# EAGLE design WAM-D (EAGLE 9.5.0)
DOCNUM: WAM-D; REV: a1; TITLE: Wizard-Architect's Mana Dock
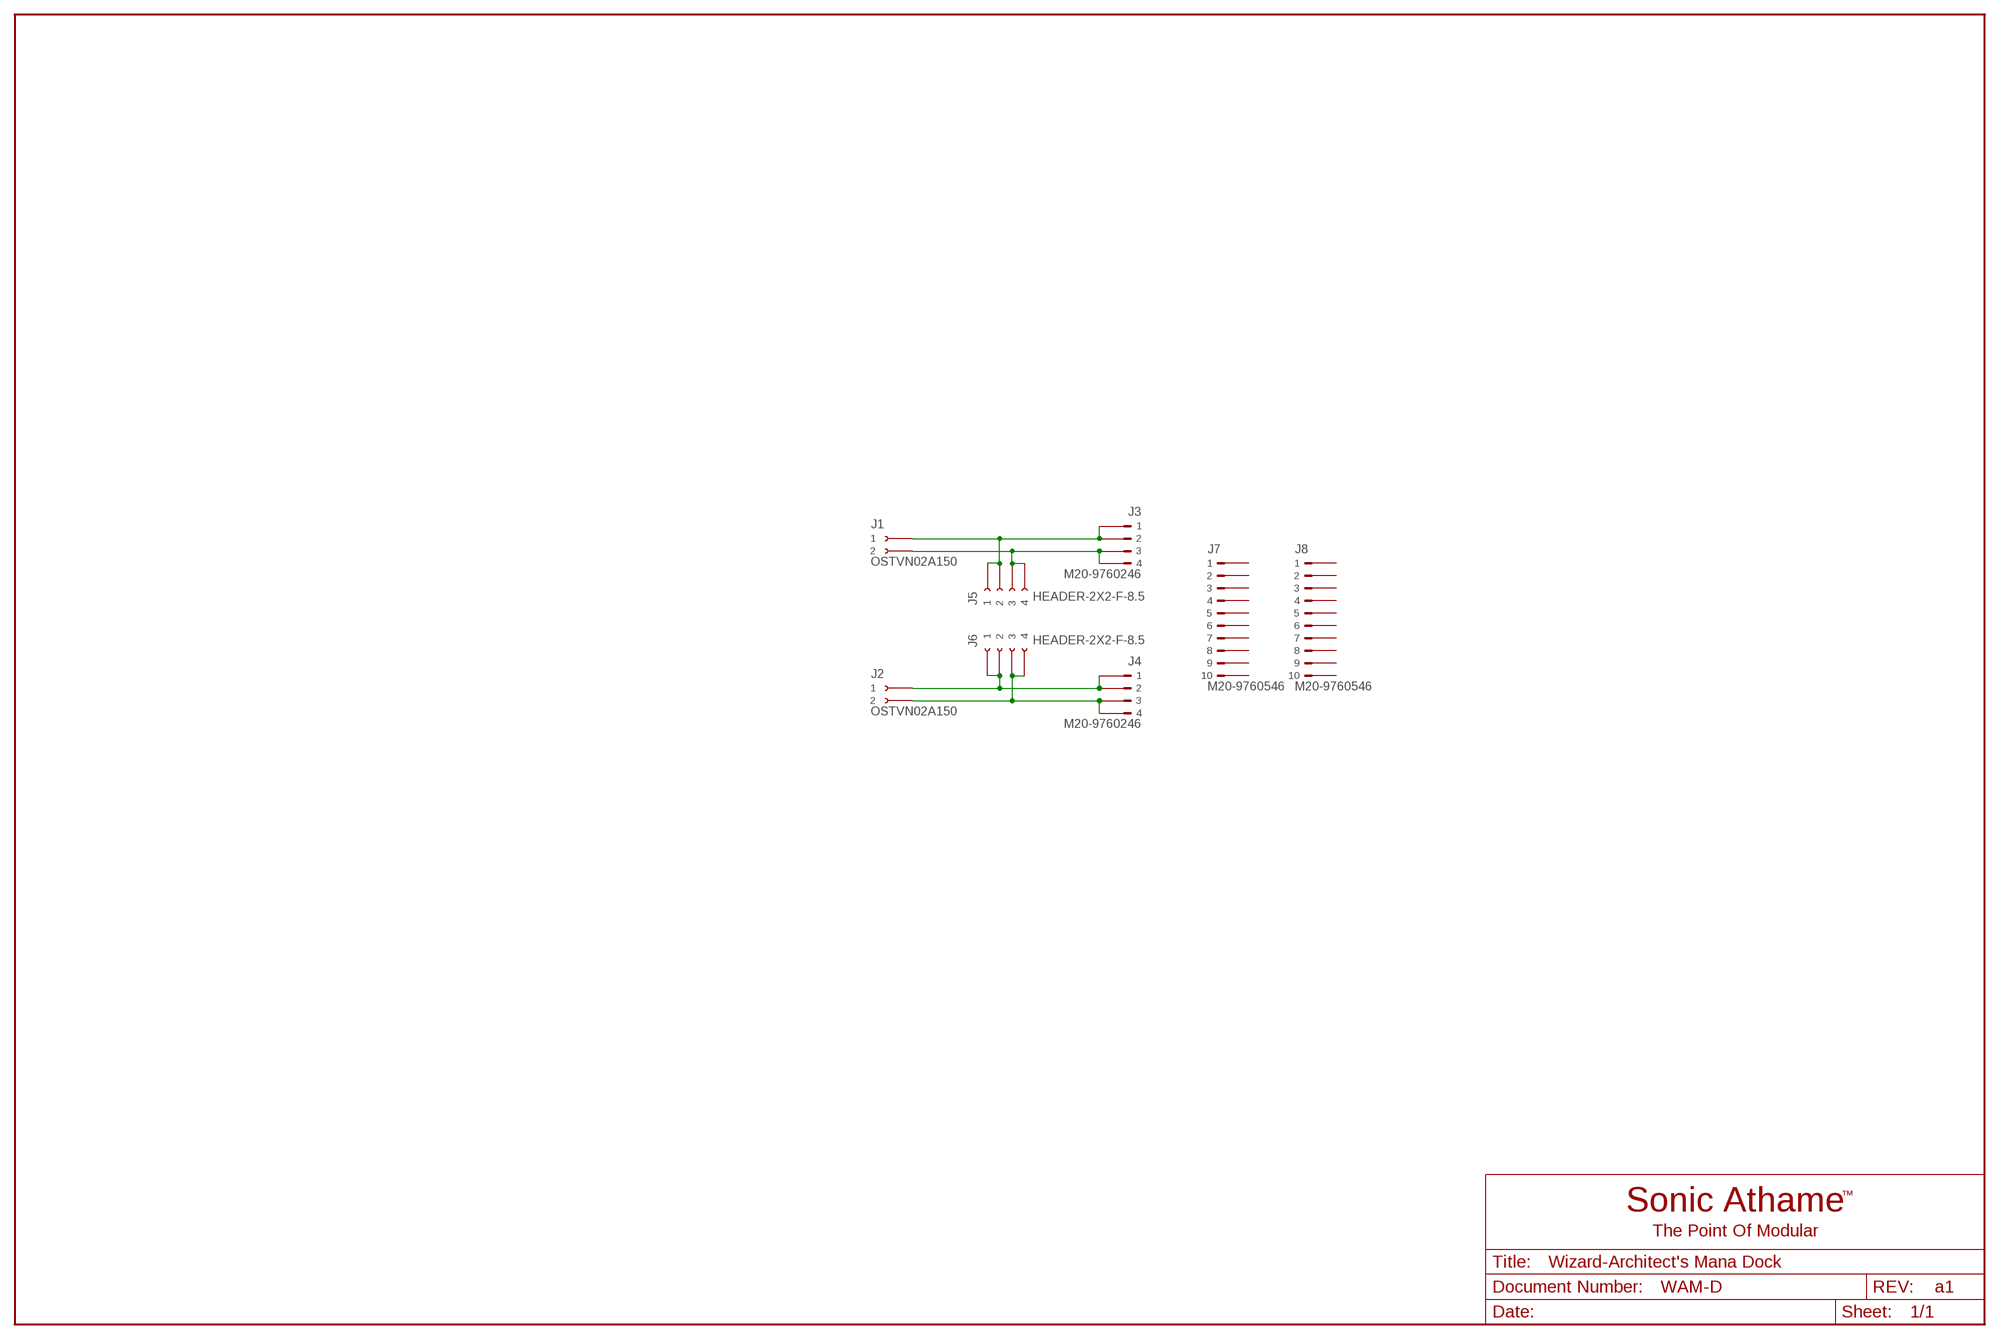
[diagram p0: schematic, sheet 1]

## Parts
J1  OSTVN02A150  [OSTVN02A150]
J2  OSTVN02A150  [OSTVN02A150]
J3  M20-9760246  [HDRV4W64P254_2X2_508X508X834B]
J4  M20-9760246  [HDRV4W64P254_2X2_508X508X834B]
J5  HEADER-2X2-F-8.5  [HDRVR4W75P254_2X2_558X508X850B]
J6  HEADER-2X2-F-8.5  [HDRVR4W75P254_2X2_558X508X850B]
J7  M20-9760546  [HDRV10W64P254_2X5_1270X508X834B]
J8  M20-9760546  [HDRV10W64P254_2X5_1270X508X834B]

## Nets
N$5: J2.P$1 J4.1 J4.2 J6.1 J6.2
N$6: J2.P$2 J4.3 J4.4 J6.3 J6.4
N$7: J1.P$2 J3.3 J3.4 J5.3 J5.4
N$8: J1.P$1 J3.1 J3.2 J5.1 J5.2
Unconnected: J7.1 J7.2 J7.3 J7.4 J7.5 J7.6 J7.7 J7.8 J7.9 J7.10 J8.1 J8.2 J8.3 J8.4 J8.5 J8.6 J8.7 J8.8 J8.9 J8.10

## Library data of the parts
J1 J2 = SonicAthame:OSTVN02A150
J3 J4 = SonicAthame:M20-9760246: Tin
J5 J6 = SonicAthame:HEADER-2X2-F-8.5
J7 J8 = SonicAthame:M20-9760546: Tin

## Board
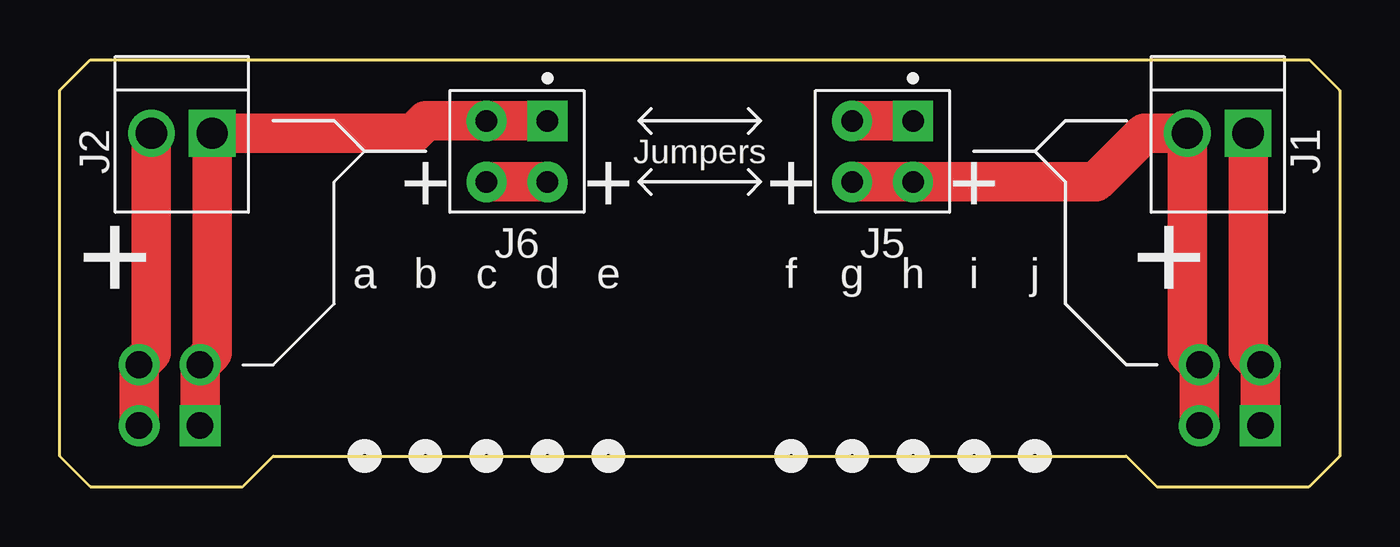
[diagram p1: board, top side]
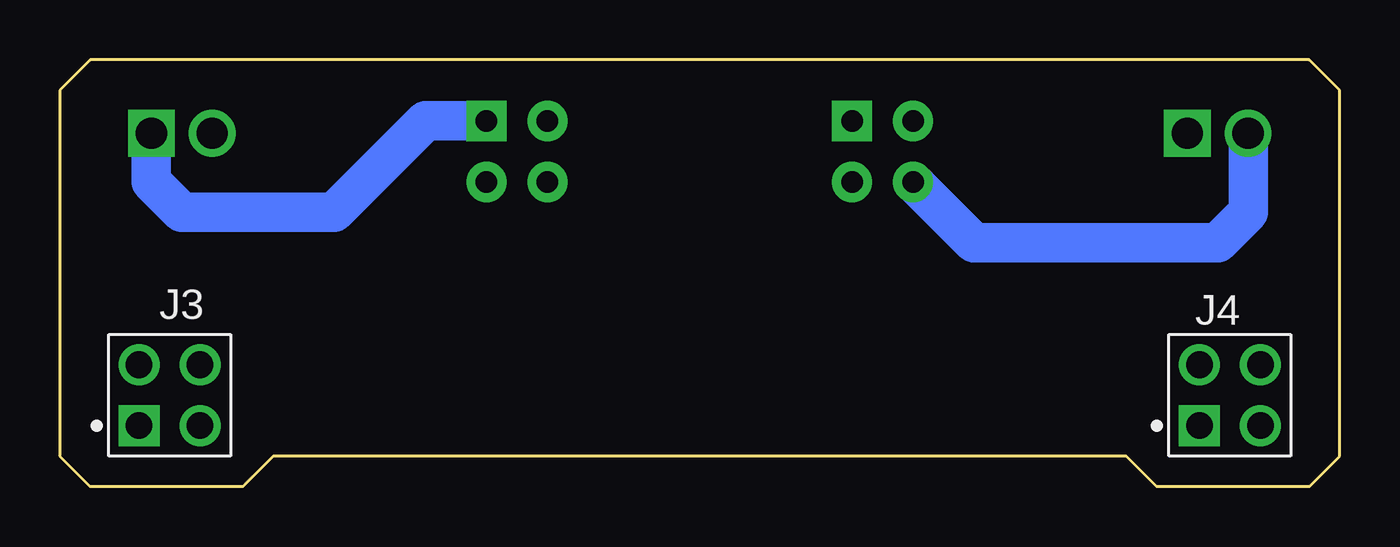
[diagram p2: board, bottom side, seen from below]

Size 53.34 x 17.78 mm. Coordinates in mm from the lower left corner, seen from the top.
Outline: 1.27,0 0,1.27 0,16.51 1.27,17.78 52.07,17.78 53.34,16.51 53.34,1.27 52.07,0 45.72,0 44.45,1.27 8.89,1.27 7.62,0 1.27,0
Copper layers (1*16): Top 0.035mm / dielectric 1.5mm / Bottom 0.035mm
Design rules "default": minimum track width 6mil, minimum drill 0.35mm, track to track 6mil, track to pad 6mil, pad to pad 6mil, via to via 6mil, smd to smd 6mil, copper to edge 40mil, drill to drill 6mil, minimum pad ring 10mil, minimum via ring 8mil, stop-mask expansion 4mil, vias tented up to drill 0mil, thermal gap 10mil

### Footprints (pad centres in the part's own frame; a part is rotated, then mirrored left to right if it is on the bottom)
OSTVN02A150 = drill 1.3 square: P$1 -1.27,0 | drill 1.3: P$2 1.27,0
HDRV4W64P254_2X2_508X508X834B = drill 1.105 pad 1.705 square: 1 0,0 | drill 1.105 pad 1.705: 2 2.54,0; 3 2.54,-2.54; 4 0,-2.54
HDRVR4W75P254_2X2_558X508X850B = drill 0.9 pad 1.676 square: 1 -1.27,-1.27 | drill 0.9 pad 1.676: 2 1.27,-1.27; 3 1.27,1.27; 4 -1.27,1.27

### Placement (x,y rotation side)
J1  48.26,14.73 180 top
J2  5.08,14.73 180 top
J3  50.04,2.54 90 bottom
J4  5.84,2.54 90 bottom
J5  34.29,13.97 180 top
J6  19.05,13.97 180 top

### Tracks (layer width: path | path; a pad name or v marks a point on that pad's centre or on a via)
N$5
  Top 1.651: J6.1 J6.2 15.24,15.24 14.73,14.73 12.7,14.73 J2.P$1 6.35,5.59 J4.2 J4.1
N$6
  Top 1.651: J2.P$2 3.81,5.59 J4.3 J4.4 | J6.3 J6.4
  Bottom 1.651: J2.P$2 3.81,11.43 5.08,10.16 15.24,10.16 J6.3
N$7
  Top 1.651: J3.4 J3.3 46.99,5.59 J1.P$2 45.21,14.73 43.18,12.7 J5.4 J5.3
N$8
  Top 1.651: J1.P$1 49.53,5.59 J3.2 J3.1 | J5.2 J5.1
  Bottom 1.651: J1.P$1 49.53,12.7 48.26,11.43 41.91,11.43 38.1,15.24 J5.1

### Text on the board
tNames: ﹣ | ﹣ | ﹣ | ﹣ | Jumpers | + | + | + | + | + | ﹣ | a | b | c | d | e | f | g | h | i | j | + | ﹣
Reference: 1 / 2 / 3 / 4 / 5 / 6 / 7 / 8 / 9 / 10 / 11 / 12 / 13 / 14 / 15 / 16 / 17 / 18 / 19 / 20 / 21 / 22 / 23 / 24 / 25 / 26 / 27 / 28 / 29 / 30 | 1 / 2 / 3 / 4 / 5 / 6 / 7 / 8 / 9 / 10 / 11 / 12 / 13 / 14 / 15 / 16 / 17 / 18 / 19 / 20 / 21 / 22 / 23 / 24 / 25 / 26 / 27 / 28 / 29 / 30 | + | ﹣ | + | ﹣ | a | b | c | d | e | f | g | h | i | j